# EAGLE design tinyRF (EAGLE 6.4)
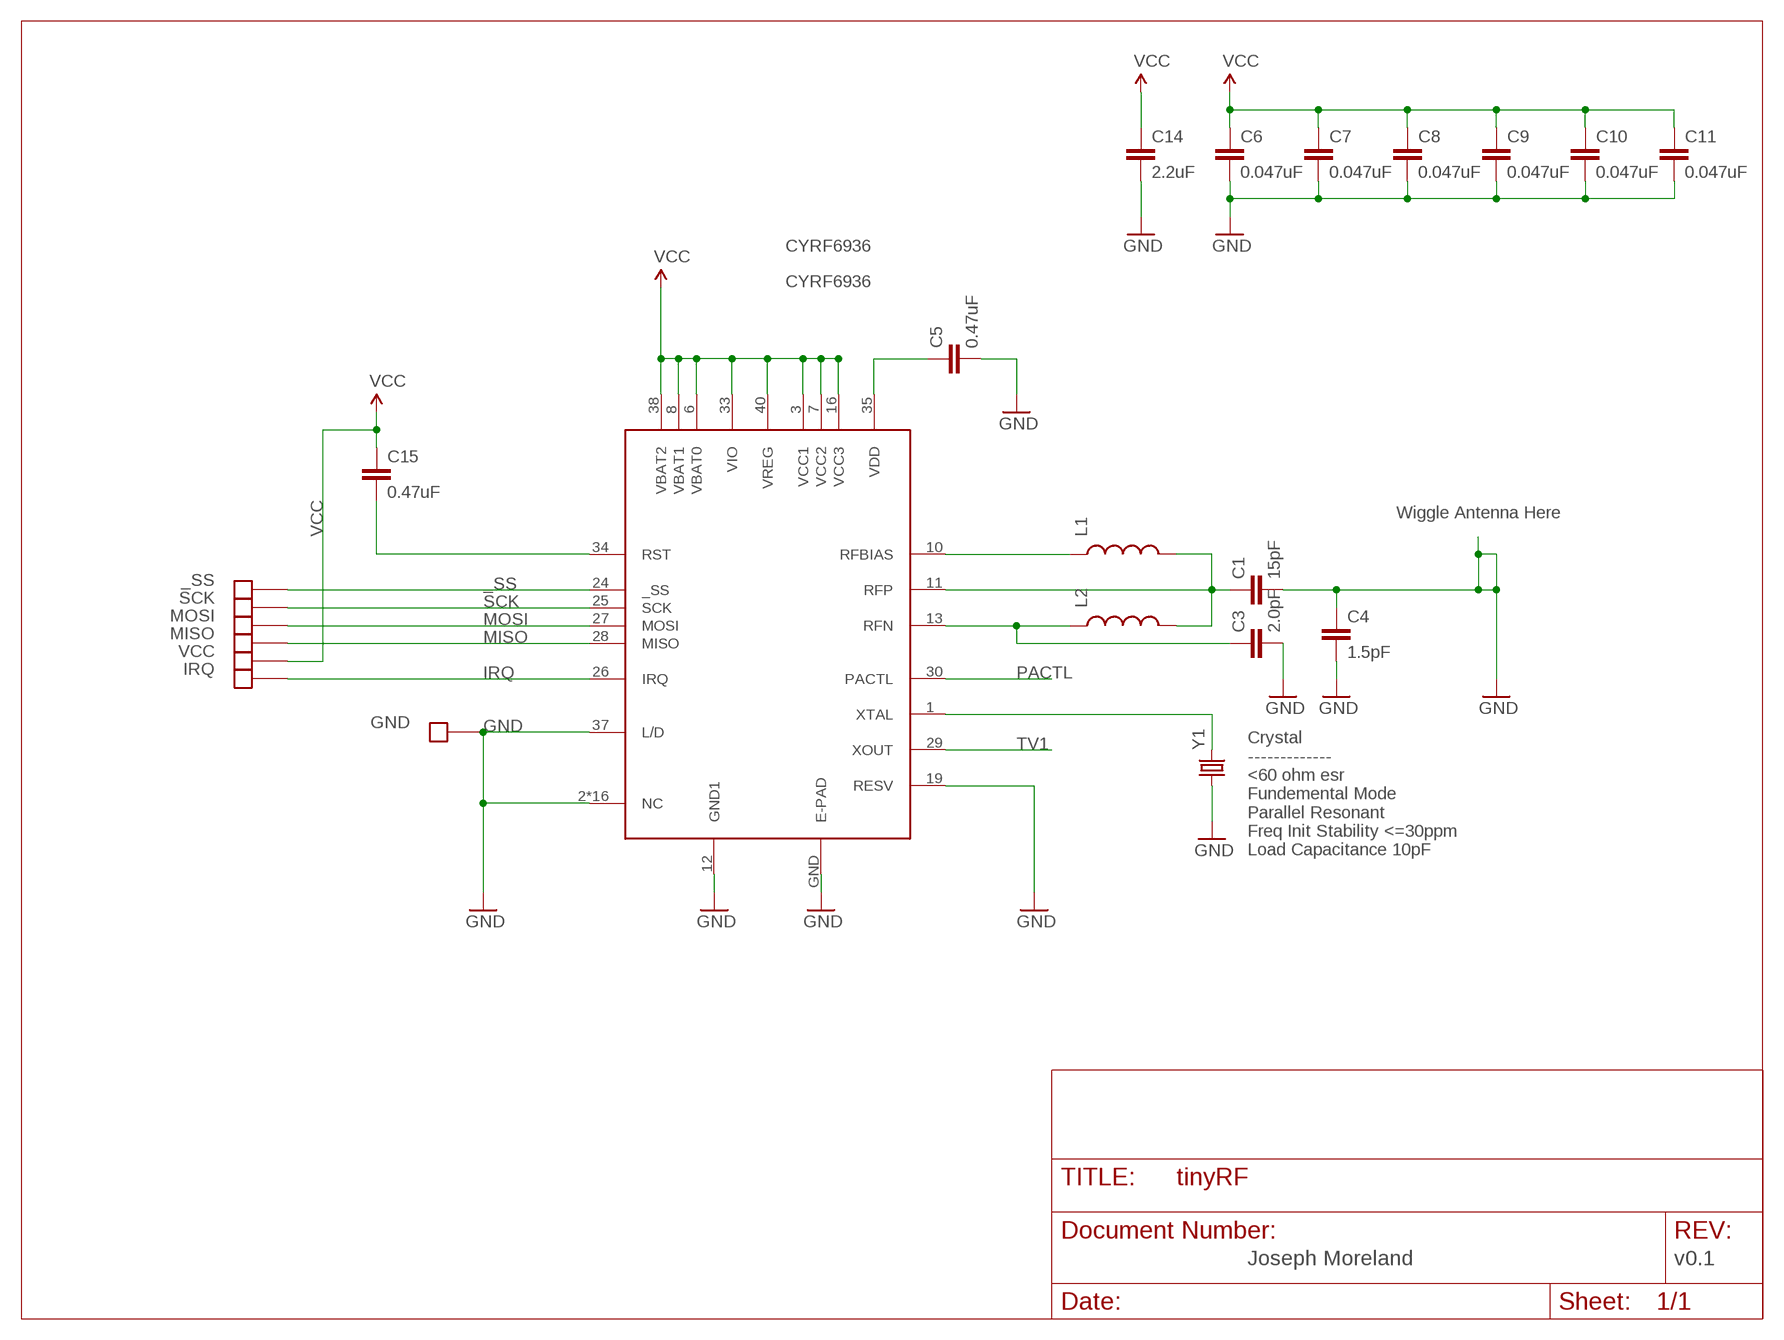
[diagram p0: schematic, sheet 1]

## Parts
_SS  SOLDER_PAD.05X.05  [SOLDER_PAD_.05X.05]
C1  15pF  CAP0402-CAP  [0402-CAP]
C3  2.0pF  CAP0402-CAP  [0402-CAP]
C4  1.5pF  CAP0402-CAP  [0402-CAP]
C5  0.47uF  CAP0402-CAP  [0402-CAP]
C6  0.047uF  CAP0402-CAP  [0402-CAP]
C7  0.047uF  CAP0402-CAP  [0402-CAP]
C8  0.047uF  CAP0402-CAP  [0402-CAP]
C9  0.047uF  CAP0402-CAP  [0402-CAP]
C10  0.047uF  CAP0402-CAP  [0402-CAP]
C11  0.047uF  CAP0402-CAP  [0402-CAP]
C14  2.2uF  CAP0805  [0805]
C15  0.47uF  CAP0402-CAP  [0402-CAP]
CYRF6936  CYRF6936  [QFN40]
GND  SOLDER_PAD.05X.05  [SOLDER_PAD_.05X.05]
IRQ  SOLDER_PAD.05X.05  [SOLDER_PAD_.05X.05]
L1  INDUCTOR0603  [0603]
L2  INDUCTOR0402  [C0402]
MISO  SOLDER_PAD.05X.05  [SOLDER_PAD_.05X.05]
MOSI  SOLDER_PAD.05X.05  [SOLDER_PAD_.05X.05]
SCK  SOLDER_PAD.05X.05  [SOLDER_PAD_.05X.05]
VCC  SOLDER_PAD.05X.05  [SOLDER_PAD_.05X.05]
Y1  CRYSTAL5X3  [CRYSTAL-SMD-5X3]

## Nets
_SS: _SS.P$1(NET) CYRF6936.24(_SS)
GND: C1.2 C3.2 C4.1 C4.2 C5.2 C6.2 C7.2 C8.2 C9.2 C10.2 C11.2 C14.2 CYRF6936.2(NC) CYRF6936.4(NC) CYRF6936.5(NC) CYRF6936.9(NC) CYRF6936.12(GND1) CYRF6936.14(NC) CYRF6936.15(NC) CYRF6936.17(NC) CYRF6936.18(NC) CYRF6936.19(RESV) CYRF6936.20(NC) CYRF6936.21(NC) CYRF6936.22(NC) CYRF6936.23(NC) CYRF6936.31(NC) CYRF6936.32(NC) CYRF6936.36(NC) CYRF6936.37(L/D) CYRF6936.39(NC) CYRF6936.GND(E-PAD) GND.P$1(NET) Y1.1
IRQ: CYRF6936.26(IRQ) IRQ.P$1(NET)
MISO: CYRF6936.28(MISO) MISO.P$1(NET)
MOSI: CYRF6936.27(MOSI) MOSI.P$1(NET)
N$2: CYRF6936.1(XTAL) Y1.3
PACTL: CYRF6936.30(PACTL)
RFBIAS: CYRF6936.10(RFBIAS) L1.1
RFN: C3.1 CYRF6936.13(RFN) L2.1
RFP: C1.1 CYRF6936.11(RFP) L1.2 L2.2
RST: C15.2 CYRF6936.34(RST)
SCK: CYRF6936.25(SCK) SCK.P$1(NET)
TV1: CYRF6936.29(XOUT)
VCC: C6.1 C7.1 C8.1 C9.1 C10.1 C11.1 C14.1 C15.1 CYRF6936.3(VCC1) CYRF6936.6(VBAT0) CYRF6936.7(VCC2) CYRF6936.8(VBAT1) CYRF6936.16(VCC3) CYRF6936.33(VIO) CYRF6936.38(VBAT2) CYRF6936.40(VREG) VCC.P$1(NET)
VDD: C5.1 CYRF6936.35(VDD)

## Notes on the sheet
- Wiggle Antenna Here
- Crystal
  -------------
  <60 ohm esr
  Fundemental Mode
  Parallel Resonant
  Freq Init Stability <=30ppm
  Load Capacitance 10pF
- Joseph Moreland | v0.1

## Library data of the parts
_SS GND IRQ MISO MOSI SCK VCC = JCM:SOLDER_PAD
C1 = SparkFun-Passives:CAP: Capacitor Standard 0603 ceramic capacitor, and 0.1" leaded capacitor.; PARTNO: C0402C150J5GACTU; VOLT: 50
C3 = SparkFun-Passives:CAP: Capacitor Standard 0603 ceramic capacitor, and 0.1" leaded capacitor.; PARTNO: C0402C209C5GACTU; VOLT: 50
C4 = SparkFun-Passives:CAP: Capacitor Standard 0603 ceramic capacitor, and 0.1" leaded capacitor.; PARTNO: C0402C159B5GACTU; VOLT: 50
C5 C15 = SparkFun-Passives:CAP: Capacitor Standard 0603 ceramic capacitor, and 0.1" leaded capacitor.; PARTNO: GRM155R60J474KE19D; VOLT: 6.3
C6-C11 = SparkFun-Passives:CAP: Capacitor Standard 0603 ceramic capacitor, and 0.1" leaded capacitor.; PARTNO: 0402YD473KAT2A
C14 = SparkFun-Passives:CAP: Capacitor Standard 0603 ceramic capacitor, and 0.1" leaded capacitor.; PARTNO: GRM21BR71A225KA01L
CYRF6936 = JCM:CYRF6936; PARTNO: CYRF6936B-40LTXC
L1 = SparkFun-Passives:INDUCTOR: Inductors Basic Inductor/Choke - 0603 and 1206. Footprints are not proven and vary greatly between part numbers.; PARTNO: ELJ-RE22NGFA
L2 = SparkFun-Passives:INDUCTOR: Inductors Basic Inductor/Choke - 0603 and 1206. Footprints are not proven and vary greatly between part numbers.; PARTNO: ELJ-RF1N8DFB
Y1 = SparkFun-FreqCtrl:CRYSTAL: Various standard crystals. Proven footprints. Spark Fun Electronics SKU : COM-00534; PARTNO: 7B-12.000MEEQ-T

## Board
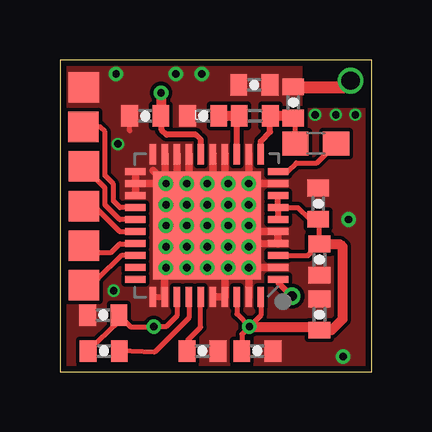
[diagram p1: board, top side]
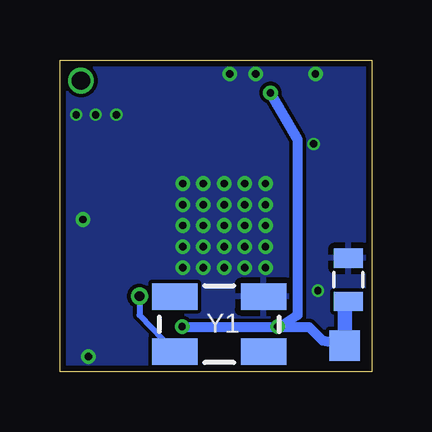
[diagram p2: board, bottom side, seen from below]

Size 13 x 13 mm. Coordinates in mm from the lower left corner, seen from the top.
Outline: 0,13 0,0 13,0 13,13 0,13
Copper layers (1*16): Top 0.035mm / dielectric 1.5mm / Bottom 0.035mm
Design rules "Fusion_eagle_rule_v1.1-JCM-restring *": minimum track width 6mil, minimum drill 12mil, track to track 6mil, track to pad 6mil, pad to pad 6mil, via to via 6mil, smd to smd 0mil, copper to edge 10mil, drill to drill 10mil, minimum pad ring 10mil, minimum via ring 2mil, stop-mask expansion 2mil, vias tented up to drill 100mil, thermal gap 10mil
tRestrict: area 10.1,11 to 13.1,13.5

### Footprints (pad centres in the part's own frame; a part is rotated, then mirrored left to right if it is on the bottom)
SOLDER_PAD_.05X.05 = smd 1.27 x 1.27: P$1 0,0
0402-CAP = smd 0.7 x 0.9: 1 -0.65,0; 2 0.65,0
0805 = smd 0.8 x 1.2: 1 -0.9,0; 2 0.9,0
QFN40 = smd 0.28 x 0.85: 1 -2.25,-2.975; 2 -1.75,-2.975; 3 -1.25,-2.975; 4 -0.75,-2.975; 5 -0.25,-2.975; 6 0.25,-2.975; 7 0.75,-2.975; 8 1.25,-2.975; 9 1.75,-2.975; 10 2.25,-2.975; 21 2.25,2.975; 22 1.75,2.975; 23 1.25,2.975; 24 0.75,2.975; 25 0.25,2.975; 26 -0.25,2.975; 27 -0.75,2.975; 28 -1.25,2.975; 29 -1.75,2.975; 30 -2.25,2.975 | smd 0.85 x 0.28: 11 2.975,-2.25; 12 2.975,-1.75; 13 2.975,-1.25; 14 2.975,-0.75; 15 2.975,-0.25; 16 2.975,0.25; 17 2.975,0.75; 18 2.975,1.25; 19 2.975,1.75; 20 2.975,2.25; 31 -2.975,2.25; 32 -2.975,1.75; 33 -2.975,1.25; 34 -2.975,0.75; 35 -2.975,0.25; 36 -2.975,-0.25; 37 -2.975,-0.75; 38 -2.975,-1.25; 39 -2.975,-1.75; 40 -2.975,-2.25 | smd 4.5 x 4.5: GND 0,0
0603 = smd 1.1 x 1: 1 -0.85,0; 2 0.85,0
C0402 = smd 0.7 x 0.9: 1 -0.65,0; 2 0.65,0
CRYSTAL-SMD-5X3 = smd 1.9 x 1.1: 1 -1.85,-1.15; 2 1.85,-1.15; 3 1.85,1.15; 4 -1.85,1.15

### Placement (x,y rotation side)
_SS  0.97,10.21 0 top
C1  9.73,11.22 90 top
C3  5.97,10.66 180 top
C4  8.11,11.96 180 top
C5  5.95,0.86 0 top
C6  3.56,10.66 180 top
C7  10.82,2.38 90 top
C8  1.81,2.36 180 top
C9  8.23,0.86 0 top
C10  10.82,4.67 270 top
C11  10.77,7.01 90 top
C14  0.97,3.83 90 bottom
C15  1.83,0.86 0 top
CYRF6936  6.13,6.09 90 top
GND  0.99,11.86 0 top
IRQ  0.99,6.9 0 top
L1  10.67,9.52 180 top
L2  8.13,10.66 0 top
MISO  0.99,3.6 0 top
MOSI  0.99,5.25 0 top
SCK  0.99,8.56 0 top
VCC  1.12,1.09 0 bottom
Y1  6.35,1.98 180 bottom

### Tracks (layer width: path | path; a pad name or v marks a point on that pad's centre or on a via)
_SS
  Top 0.203: CYRF6936.24 2.51,6.84 2.24,7.11 2.24,7.82 1.88,8.17 1.88,10 1.68,10.21 _SS.P$1
GND  (via drill 0.3 pad 0.51, 0.3 pad 0.61)
  Top 0.203: 2.91,10.03 C6.2
  Top 0.254: CYRF6936.31 CYRF6936.32 | 4.37,5.58 5.38,5.58 5.38,6.09 | 9.11,5.85 CYRF6936.5 | 7.75,5.36 7.75,6.09 CYRF6936.GND | v7.88,4.34 | CYRF6936.39 | 4.88,7.84 v5.29,7.84 | 4.38,7.84 v4.42,7.84 | 7.75,4.49 7.75,5.28
  Top 0.305: CYRF6936.17 5.38,6.09 | CYRF6936.32 4.37,5.58 | CYRF6936.5 7.83,5.84 | CYRF6936.5 9.1,5.33 7.75,5.36 | CYRF6936.2 v7.88,4.34 | CYRF6936.39 v7.88,4.34 | CYRF6936.18 4.88,7.84 | CYRF6936.19 4.38,7.84 | 3.88,8.39 v4.42,7.84 CYRF6936.22 CYRF6936.23 | CYRF6936.22 CYRF6936.21 | CYRF6936.9 v7.88,7.84 v7.88,7.85 CYRF6936.12 | CYRF6936.14 6.88,7.98 v7.01,7.84 | CYRF6936.15 6.38,8.07 v6.15,7.84 | CYRF6936.36 CYRF6936.37 6.88,4.2 v7.01,4.34
  Top 0.406: 5.38,6.09 CYRF6936.GND
  Top 0.508: C1.2 11.86,11.87 12.12,12.14
  other vias: 7.88,6.95 7.01,6.95 6.15,6.95 5.29,6.95 4.42,6.95 7.88,6.09 7.01,6.09 6.15,6.09 5.29,6.09 4.42,6.09 7.88,5.2 7.01,5.2 6.15,5.2 5.29,5.2 4.42,5.2 6.15,4.34 5.29,4.34 4.42,4.34 2.34,12.42 2.42,9.49 5.92,12.42 11.82,0.63 4.83,12.42 12.04,6.35 2.24,3.37 10.65,10.71 12.32,10.71 11.51,10.71
  pour Bottom: -0.33,-0.45 13.17,-0.45 13.17,13.55 -0.33,13.55
  pour Top (rank 2, no thermals): -0.33,-0.45 13.17,-0.45 13.17,13.55 -0.33,13.55
IRQ
  Top 0.203: CYRF6936.26 2.49,5.84 1.43,6.9 IRQ.P$1
MISO
  Top 0.203: CYRF6936.28 2.56,4.84 1.58,3.86 1.25,3.86 MISO.P$1
MOSI
  Top 0.203: MOSI.P$1 1.2,5.25 1.48,4.97 2.14,4.97 2.49,5.33 3.14,5.33 CYRF6936.27
N$1  (via drill 0.76 pad 1.07)
  other vias: 12.12,12.14
N$2  (via drill 0.41 pad 0.71)
  Top 0.254: CYRF6936.1 9.1,3.73 v9.68,3.15
  Bottom 0.254: v9.68,3.15 9.68,2.36 Y1.3
RFBIAS
  Top 0.203: CYRF6936.10 9.49,8.34 9.86,8.71 10.71,8.71 L1.1
RFN
  Top 0.152: 7.38,10.56 L2.1
  Top 0.254: CYRF6936.13 7.38,10.56
  Top 0.406: L2.1 C3.1
RFP
  Top 0.152: 8.77,10.65 L2.2
  Top 0.203: 9.82,10.66 C1.1 9.82,10.48 L1.2
  Top 0.254: CYRF6936.11 8.38,9.61 8.77,10 8.77,10.65
  Top 0.406: 9.82,10.66 L2.2
RST
  Top 0.203: CYRF6936.34 5.38,2.24 3.94,0.81 C15.2
SCK
  Top 0.203: CYRF6936.25 2.5,6.34 1.88,6.96 1.88,7.67 SCK.P$1
VCC  (via drill 0.3 pad 0.61)
  Top 0.152: 4.04,10.89 C6.1 4.25,10.63
  Top 0.203: 5.88,9.67 5.67,9.88 | CYRF6936.7 9.11,6.83 9.94,6.83 10.41,6.36 C11.1 10.82,6.31 C10.1 10.35,4.84 CYRF6936.3 | 4.22,10.67 C6.1 | CYRF6936.38 7.38,2.4 v7.9,1.88 | CYRF6936.40 8.38,2.35 v7.9,1.88 | v7.9,1.88 7.58,1.56 C9.1 | CYRF6936.33 4.88,2.33 4.42,1.88 v3.92,1.88 2.94,1.88 C8.1 2.46,2.08 C15.1
  Top 0.254: CYRF6936.6 CYRF6936.7 CYRF6936.8 | CYRF6936.16 5.88,9.67 | 5.67,9.88 4.45,9.88 4.25,10.08 4.25,10.63
  Top 0.406: v4.22,11.63 4.22,10.67 | C10.1 11.67,5.32 11.79,5.2 11.79,2.18 11.34,1.73 C7.1 10.68,1.88 v7.9,1.88
  Bottom 0.254: 3.89,1.85 v3.92,1.88
  Bottom 0.406: v7.9,1.88 v3.92,1.88 3.81,1.88 3.08,2.36 3.08,9.67 v4.22,11.63 | VCC.P$1 2.04,1.29 2.59,1.85 3.89,1.85
  Bottom 0.61: C14.1 1.12,2.93 VCC.P$1
VDD
  Top 0.203: C5.1 5.32,1.3 5.87,1.85 CYRF6936.35

### Text on the board
bDocu: CYRF6936-BoB / v0.1 / 18 Apr 2013